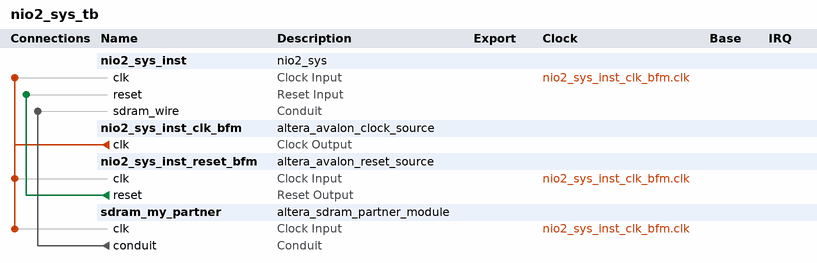
[diagram p0: system contents]
# Platform Designer (Qsys) system nio2_sys_tb, Cyclone V 5CSEMA5F31C6
# Parameters at their usual value, and those the tool derives, are not listed.
package require -exact qsys 18.1
create_system nio2_sys_tb
set_project_property DEVICE_FAMILY {Cyclone V}
set_project_property DEVICE 5CSEMA5F31C6

add_instance nio2_sys_inst nio2_sys 1.0

add_instance nio2_sys_inst_clk_bfm altera_avalon_clock_source 18.1

add_instance nio2_sys_inst_reset_bfm altera_avalon_reset_source 18.1
set_instance_parameter_value nio2_sys_inst_reset_bfm ASSERT_HIGH_RESET 0
set_instance_parameter_value nio2_sys_inst_reset_bfm INITIAL_RESET_CYCLES 50

add_instance sdram_my_partner altera_sdram_partner_module 11.0
set_instance_parameter_value sdram_my_partner CONTR_NAME nio2_sys_sdram
set_instance_parameter_value sdram_my_partner SDRAM_COL_WIDTH 8
set_instance_parameter_value sdram_my_partner SDRAM_DATA_WIDTH 16
set_instance_parameter_value sdram_my_partner SDRAM_ROW_WIDTH 12

# connections
add_connection nio2_sys_inst_clk_bfm.clk nio2_sys_inst.clk clock
add_connection nio2_sys_inst_clk_bfm.clk nio2_sys_inst_reset_bfm.clk clock
add_connection nio2_sys_inst_clk_bfm.clk sdram_my_partner.clk clock
add_connection nio2_sys_inst_reset_bfm.reset nio2_sys_inst.reset reset
add_connection sdram_my_partner.conduit nio2_sys_inst.sdram_wire conduit

set_interconnect_requirement {$system} qsys_mm.clockCrossingAdapter HANDSHAKE
set_interconnect_requirement {$system} qsys_mm.enableEccProtection FALSE
set_interconnect_requirement {$system} qsys_mm.insertDefaultSlave FALSE
set_interconnect_requirement {$system} qsys_mm.maxAdditionalLatency 1

save_system nio2_sys_tb.qsys
